# Altium schematic sheet Powersupply.SchDoc
size A4; SheetNumber: 1; SheetTotal: 4
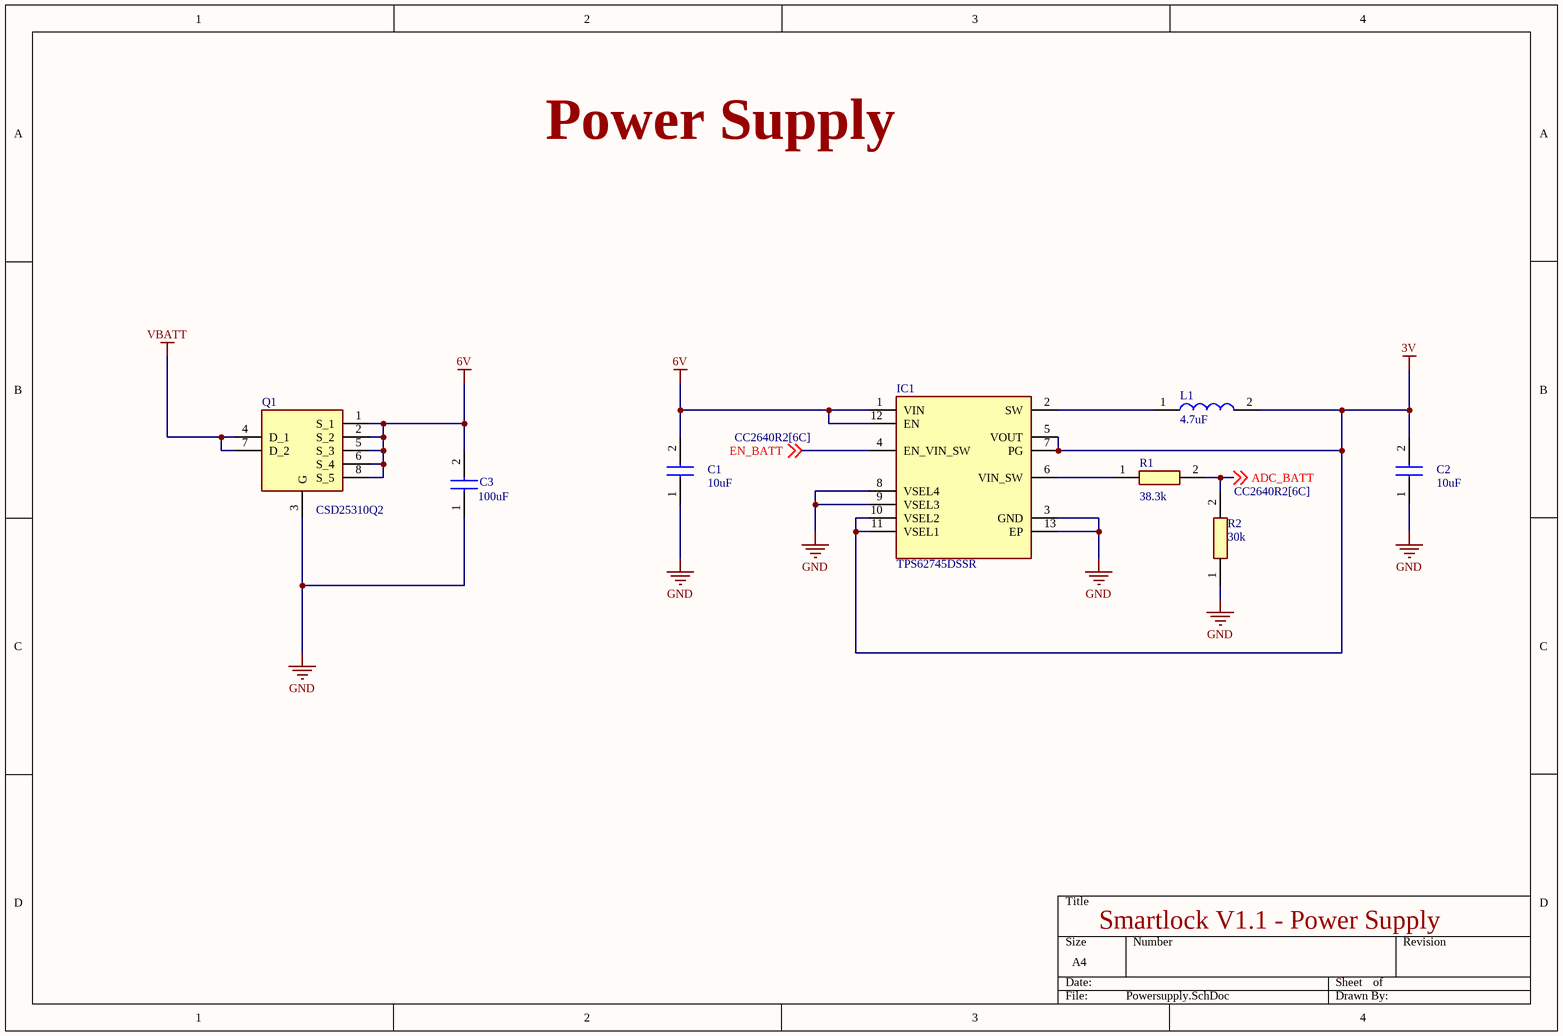
[diagram p0: Powersupply.SchDoc]

## Parts
C1  10uF  [CAPC2114X145N]
C2  10uF  [CAPC2114X145N]
C3  100uF  [CAPC3216X180N]
IC1  TPS62745DSSR  [SON50P200X300X80-13N]
L1  4.7uF  [INDC3225X270N]
Q1  CSD25310Q2  [CSD17313Q2]
R1  38.3k  [RESC1608X55N]
R2  30k  [RESC1608X55N]

## Nets
3V: C2.2 IC1.5(VOUT) IC1.7(PG) IC1.10(VSEL2) IC1.11(VSEL1) L1.2
6V: C1.2 C3.2 IC1.1(VIN) IC1.12(EN) Q1.1(S_1) Q1.2(S_2) Q1.5(S_3) Q1.6(S_4) Q1.8(S_5)
GND: C1.1 C2.1 C3.1 IC1.3(GND) IC1.8(VSEL4) IC1.9(VSEL3) IC1.13(EP) Q1.3(G) R2.1
VBATT: Q1.4(D_1) Q1.7(D_2)
ADC_BATT: R1.2 R2.2 ; off-sheet ADC_BATT
EN_BATT: IC1.4(EN_VIN_SW) ; off-sheet EN_BATT
NetIC1_2: IC1.2(SW) L1.1
NetIC1_6: IC1.6(VIN_SW) R1.1

## Notes on the sheet
- Power Supply
- Smartlock V1.1 - Power Supply

## Library data of the parts
C1 = EMK212BB7106MG-T: 10uF,16V,X7R; Manufacturer_Name: TAIYO YUDEN; Datasheet Link: https://datasheet.datasheetarchive.com/originals/distributors/Datasheets-DGA20/25674.pdf; Height: 1.45mm; Manufacturer_Part_Number: EMK212BB7106MG-T; Mouser Part Number: 963-EMK212BB7106MG-T; Mouser Price/Stock: https://www.mouser.co.uk/ProductDetail/TAIYO-YUDEN/EMK212BB7106MG-T?qs=CNQs48zzdnoVUZzBq71rnA%3D%3D
C2 = EMK212BB7106MG-T: Capacitor,10uF,16V; Manufacturer_Name: TAIYO YUDEN; Datasheet Link: https://datasheet.datasheetarchive.com/originals/distributors/Datasheets-DGA20/25674.pdf; Height: 1.45mm; Manufacturer_Part_Number: EMK212BB7106MG-T; Mouser Part Number: 963-EMK212BB7106MG-T; Mouser Price/Stock: https://www.mouser.co.uk/ProductDetail/TAIYO-YUDEN/EMK212BB7106MG-T?qs=CNQs48zzdnoVUZzBq71rnA%3D%3D
C3 = C3216X5R1A107M160AC: Capacitor,100uF,X7R; Manufacturer_Name: TDK; Datasheet Link: https://product.tdk.com/info/en/catalog/datasheets/mlcc_commercial_midvoltage_en.pdf; Height: 1.8mm; Manufacturer_Part_Number: C3216X5R1A107M160AC; Mouser Part Number: 810-C3216X5R1A107M; Mouser Price/Stock: https://www.mouser.co.uk/ProductDetail/TDK/C3216X5R1A107M160AC?qs=NRhsANhppD%252B0MpDu1pf9NA%3D%3D; Arrow Part Number: C3216X5R1A107M160AC; Arrow Price/Stock: https://www.arrow.com/en/products/c3216x5r1a107m160ac/tdk?region=nac
IC1 = TPS62745DSSR: Integrated Circuit; Manufacturer_Name: Texas Instruments; Datasheet Link: http://www.ti.com/lit/gpn/tps62745; Height: 0.8mm; Manufacturer_Part_Number: TPS62745DSSR; Mouser Part Number: 595-TPS62745DSSR; Mouser Price/Stock: https://www.mouser.co.uk/ProductDetail/Texas-Instruments/TPS62745DSSR?qs=cGEy3R83DS9Bx52nwzd43Q%3D%3D; Arrow Part Number: TPS62745DSSR; Arrow Price/Stock: https://www.arrow.com/en/products/tps62745dssr/texas-instruments?region=nac
L1 = CBC3225T4R7MRV: Inductor,4.7uF,1.01A,0.1ohm; Manufacturer_Name: TAIYO YUDEN; Datasheet Link: https://www.arrow.com/en/products/cbc3225t4r7mrv/taiyo-yuden; Height: 2.7mm; Manufacturer_Part_Number: CBC3225T4R7MRV; Mouser Part Number: 963-CBC3225T4R7MRV; Mouser Price/Stock: https://www.mouser.co.uk/ProductDetail/TAIYO-YUDEN/CBC3225T4R7MRV?qs=DpxmIIQLg%252BP760DvOSan2w%3D%3D; Arrow Part Number: CBC3225T4R7MRV; Arrow Price/Stock: https://www.arrow.com/en/products/cbc3225t4r7mrv/taiyo-yuden
Q1 = CSD25310Q2: MOSFET (P-Channel); Manufacturer_Name: Texas Instruments; Datasheet Link: http://www.ti.com/lit/gpn/csd25310q2; Manufacturer_Part_Number: CSD25310Q2; Mouser Part Number: 595-CSD25310Q2; Mouser Price/Stock: https://www.mouser.co.uk/ProductDetail/Texas-Instruments/CSD25310Q2?qs=%252BFzhjShcsaLmTjZr5cnj9w%3D%3D; Arrow Part Number: CSD25310Q2; Arrow Price/Stock: https://www.arrow.com/en/products/csd25310q2/texas-instruments?region=nac
R1 = RC0603FR-0738K3L: Resistor,38.3k; Manufacturer_Name: KEMET; Datasheet Link: http://www.yageo.com/documents/recent/PYu-RC0603_51_RoHS_L_v5.pdf; Height: 0.55mm; Manufacturer_Part_Number: RC0603FR-0738K3L
R2 = ERJ-3EKF3002V: Resistor,30k,1%; Manufacturer_Name: Panasonic; Datasheet Link: http://industrial.panasonic.com/cdbs/www-data/pdf/RDA0000/AOA0000C86.pdf; Height: 0.55mm; Manufacturer_Part_Number: ERJ-3EKF3002V; Mouser Part Number: 667-ERJ-3EKF3002V; Mouser Price/Stock: https://www.mouser.co.uk/ProductDetail/Panasonic/ERJ-3EKF3002V?qs=MVjVSMjNRMoByeEjjMcfzA%3D%3D; Arrow Part Number: ERJ-3EKF3002V; Arrow Price/Stock: https://www.arrow.com/en/products/erj3ekf3002v/panasonic?region=nac